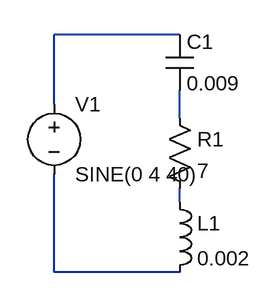
[diagram p0: schematic rclser.asc]
rclser.asc, the LTspice schematic file:
Version 4
SHEET 1 880 680
WIRE 240 48 96 48
WIRE 96 128 96 48
WIRE 240 144 240 112
WIRE 240 240 240 224
WIRE 96 320 96 208
WIRE 240 320 96 320
SYMBOL voltage 96 112 R0
WINDOW 123 0 0 Left 0
WINDOW 39 0 0 Left 0
SYMATTR InstName V1
SYMATTR Value SINE(0 4 40)
SYMBOL cap 224 48 R0
SYMATTR InstName C1
SYMATTR Value 0.009
SYMBOL res 224 128 R0
SYMATTR InstName R1
SYMATTR Value 7
SYMBOL ind 224 224 R0
SYMATTR InstName L1
SYMATTR Value 0.002

The netlist it stands for:
* rclser.asc
V1 N001 N004 SINE(0 4 40)
C1 N001 N002 0.009
R1 N002 N003 7
L1 N003 N004 0.002
.backanno
.end